# EAGLE design compass (EAGLE 9.6.1)
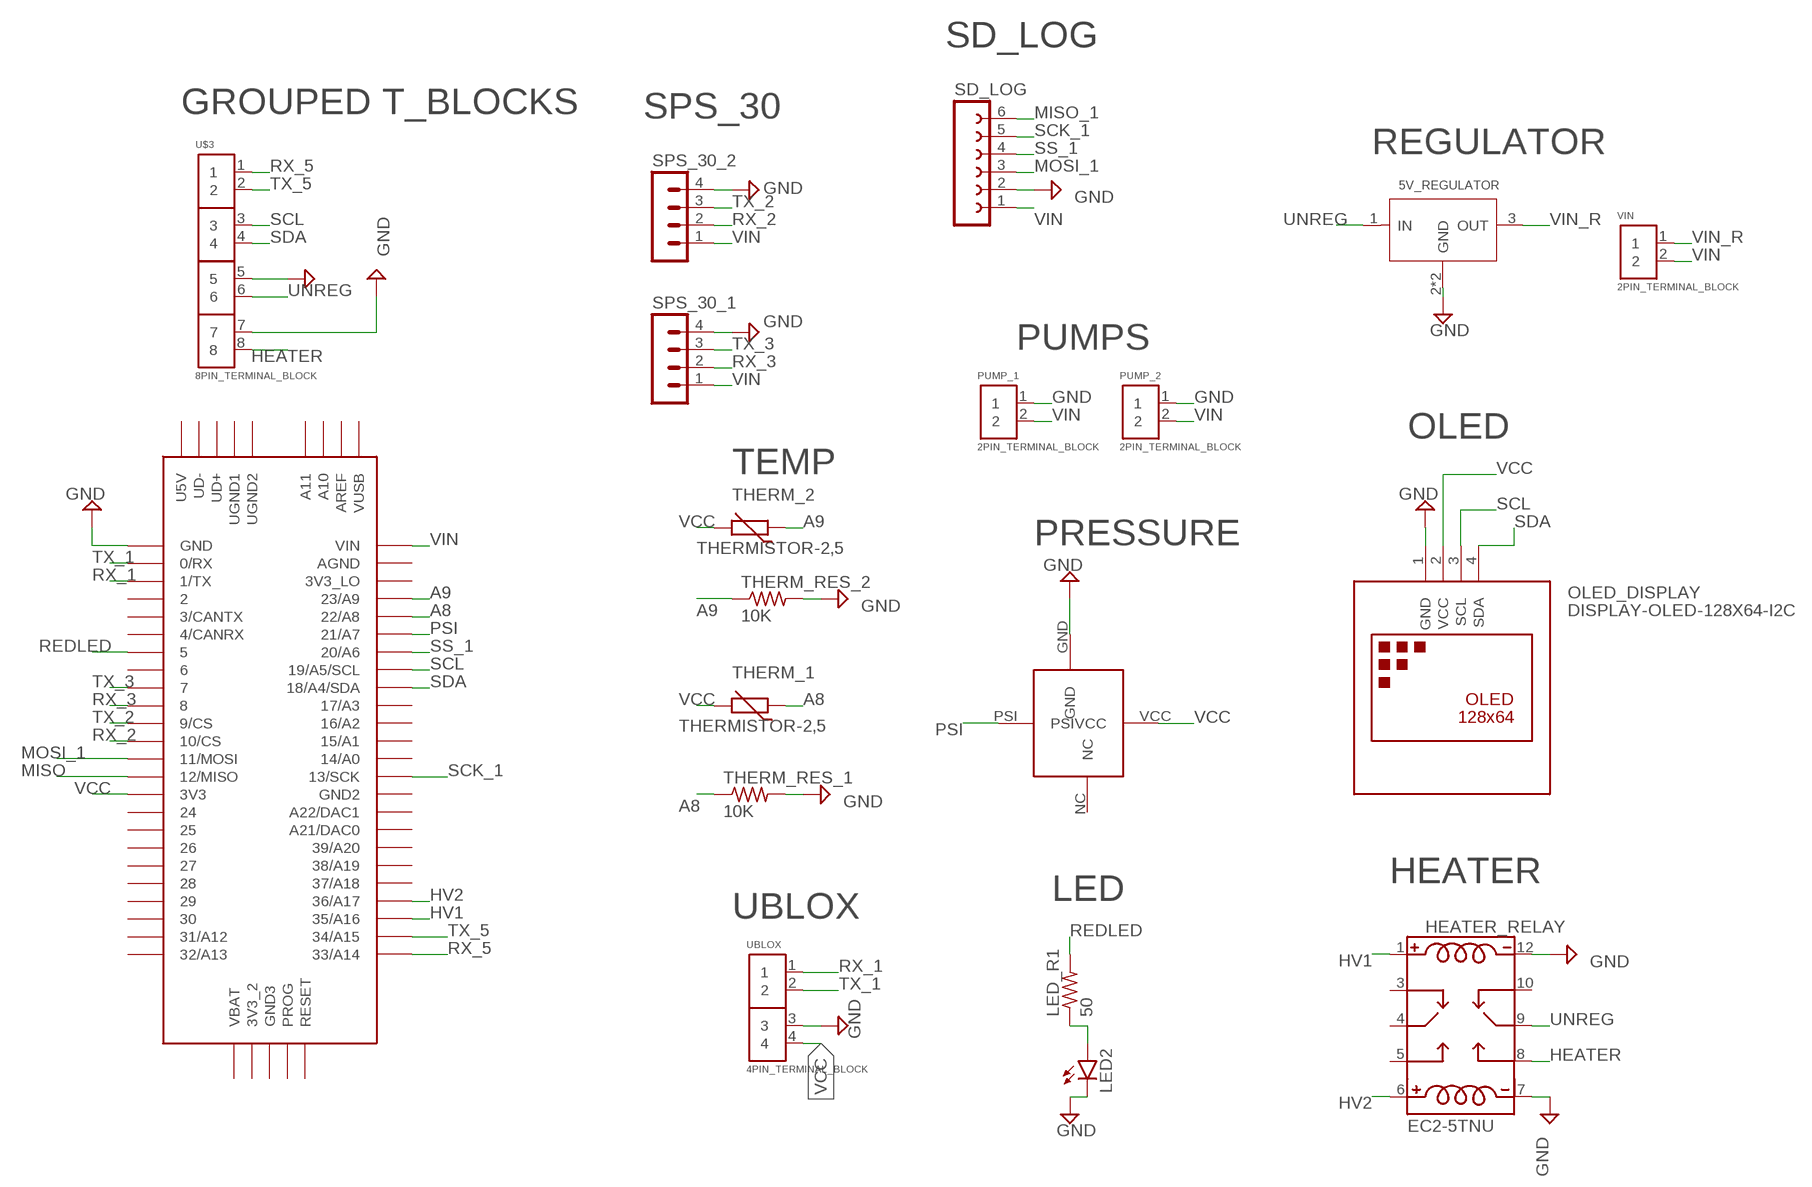
[diagram p0: schematic, sheet 1]

## Parts
5V_REGULATOR  PMIC-L7805CV-DG(TO-220)  [TO-220]
HEATER_RELAY  EC2-5TNU  [RELAY_EC2-5TNU]
LED2  TLLR4400  [LED3MM]
LED_R1  50  R-US_0204/7  [0204/7]
OLED_DISPLAY  DISPLAY-OLED-128X64-I2C  [DISPLAY-OLED-128X64-I2C]
PRESSURE_SENSOR  SSCSANN015PAAA5  [SSCSANN015PAAA5]
PUMP_1  2PIN_TERMINAL_BLOCK  [2PIN_TERMINAL_BLOCK]
PUMP_2  2PIN_TERMINAL_BLOCK  [2PIN_TERMINAL_BLOCK]
SD_LOG  FE06-1  [FE06]
SPS_30_1  MA04-1  [MA04-1]
SPS_30_2  MA04-1  [MA04-1]
THERM_1  THERMISTOR-2,5  [RS-2,5]
THERM_2  THERMISTOR-2,5  [RS-2,5]
THERM_RES_1  10K  R-US_0204/7  [0204/7]
THERM_RES_2  10K  R-US_0204/7  [0204/7]
U$1  TEENSY_3.5/3.6  [TEENSY_3.5/3.6]
U$3  8PIN_TERMINAL_BLOCK  [8PIN_TERMINAL_BLOCK]
UBLOX  4PIN_TERMINAL_BLOCK  [4PIN_TERMINAL_BLOCK]
VIN  2PIN_TERMINAL_BLOCK  [2PIN_TERMINAL_BLOCK]

## Nets
A8: THERM_1.1 THERM_RES_1.1 U$1.22/A8
A9: THERM_2.1 THERM_RES_2.1 U$1.23/A9
GND [5V_Relay]: 5V_REGULATOR.2(GND) 5V_REGULATOR.HEAT(GND) HEATER_RELAY.7(C4) HEATER_RELAY.12(C2) LED2.K(C) OLED_DISPLAY.1(GND) PRESSURE_SENSOR.GND PUMP_1.1 PUMP_2.1 SD_LOG.2 SPS_30_1.4 SPS_30_2.4 THERM_RES_1.2 THERM_RES_2.2 U$1.GND U$3.5 U$3.7 UBLOX.3
HEATER: HEATER_RELAY.8(NO) U$3.8
HV1 [5V_Relay]: HEATER_RELAY.1(C1) U$1.35/A16
HV2 [5V_Relay]: HEATER_RELAY.6(C3) U$1.36/A17
MISO: U$1.12/MISO
MISO_1: SD_LOG.6
MOSI_1: SD_LOG.3 U$1.11/MOSI
N$4: LED2.A LED_R1.1
PSI: PRESSURE_SENSOR.PSI U$1.21/A7
REDLED: LED_R1.2 U$1.5
RX_1: U$1.1/TX UBLOX.1
RX_2: SPS_30_2.2 U$1.10/CS
RX_3: SPS_30_1.2 U$1.8
RX_5: U$1.33/A14 U$3.1
SCK_1: SD_LOG.5 U$1.13/SCK
SCL: OLED_DISPLAY.3(SCL) U$1.19/A5/SCL U$3.3
SDA: OLED_DISPLAY.4(SDA) U$1.18/A4/SDA U$3.4
SS_1: SD_LOG.4 U$1.20/A6
TX_1: U$1.0/RX UBLOX.2
TX_2: SPS_30_2.3 U$1.9/CS
TX_3: SPS_30_1.3 U$1.7
TX_5: U$1.34/A15 U$3.2
UNREG: 5V_REGULATOR.1(IN) HEATER_RELAY.9(M) U$3.6
VCC: OLED_DISPLAY.2(VCC) PRESSURE_SENSOR.VCC THERM_1.2 THERM_2.2 U$1.3V3 UBLOX.4
VIN: PUMP_1.2 PUMP_2.2 SD_LOG.1 SPS_30_1.1 SPS_30_2.1 U$1.VIN VIN.2
VIN_R: 5V_REGULATOR.3(OUT) VIN.1
Unconnected: HEATER_RELAY.3(NC1) HEATER_RELAY.4(M1) HEATER_RELAY.5(NO1) HEATER_RELAY.10(NC) PRESSURE_SENSOR.NC U$1.2 U$1.3/CANTX U$1.3V3_2 U$1.3V3_LO U$1.4/CANRX U$1.6 U$1.14/A0 U$1.15/A1 U$1.16/A2 U$1.17/A3 U$1.21/DAC0(A21/DAC0) U$1.24 U$1.25 U$1.26 U$1.27 U$1.28 U$1.29 U$1.30 U$1.31/A12 U$1.32/A13 U$1.37/A18 U$1.38/A19 U$1.39/A20 U$1.A10 U$1.A11 U$1.A22/DAC1 U$1.AGND U$1.AREF U$1.GND2 U$1.GND3 U$1.PROG U$1.RESET U$1.U5V U$1.UD+ U$1.UD- U$1.UGND1 U$1.UGND2 U$1.VBAT U$1.VUSB

## Notes on the sheet
- SD_LOG
- SPS_30
- GROUPED T_BLOCKS | REGULATOR
- PUMPS
- OLED
- TEMP
- PRESSURE
- HEATER
- LED
- UBLOX

## Library data of the parts
5V_REGULATOR = PMIC-L7805CV-DG_TO-220_:PMIC-L7805CV-DG(TO-220): 310030073; DESCRIPTION: Linear Voltage Regulator IC 1 Output 1.5A TO-220; DIGI-KEY_PART_NUMBER: 497-12404-ND; MF: STMicroelectronics; MP: L7805CV-DG; PACKAGE: TO-220 STMicroelectronics
HEATER_RELAY = EC2-5TNU:EC2-5TNU: Relay; E-Mech; Latching; DPDT; Ctrl-V 5DC; 2A; 250VAC; PCB Mnt; Thru Hole; EC2/EE2 Series; AVAILABILITY: Unavailable; DESCRIPTION: Relay; E-Mech; Latching; DPDT; Ctrl-V 5DC; 2A; 250VAC; PCB Mnt; Thru Hole; EC2/EE2 Series; MF: KEMET; MP: EC2-5TNU; PACKAGE: None; PRICE: None
LED2 = led:TLLR4400: Low Current (2mA) LED 3 mm Tinted Diffused Package color RED Source: Data sheet <http://www.farnell.com/datasheets/391100.pdf>; MF: VISHAY SEMICONDUCTOR; OC_FARNELL: 1612437
LED_R1 = resistor:R-US_: RESISTOR, American symbol
OLED_DISPLAY = diy-modules:DISPLAY-OLED-128X64-I2C: 128x64 Dot Matrix OLED Module based on SSD1306 chip Variant with I2C interface More details available here: http://www.instructables.com/id/Monochrome-096-i2c-OLED-display-with-arduino-SSD13/ SSD1306 datasheet: https://cdn-shop.adafruit.com/datasheets/SSD1306.pdf Click here to find device on ebay.com <http://www.ebay.com/sch/oled+display+128x64+iic> Note: There are two variants: I2C and SPI. Search for the proper version.
PRESSURE_SENSOR = SSCSANN015PAAA5:SSCSANN015PAAA5
PUMP_1 PUMP_2 VIN = Terminal_Block:2PIN_TERMINAL_BLOCK: Terminal block; 2.54mm; angled 90°; 0.03÷1mm2; ways: 2; 10A; H: 10mm; CENTERLINE_PITCH: 2.54 mm[.1 in]; COMMENT: 282834-2; DESCRIPTION: TERMI-BLOK PCB MOUNT, 90 2P.; DIGI-KEY_PART_NUMBER: A98333-ND; DIGI-KEY_PURCHASE_URL: https://www.digikey.com/product-detail/en/te-connectivity-amp-connectors/282834-2/A98333-ND/1150135?utm_source=snapeda&utm_medium=aggregator&utm_campaign=symbol; EU_ROHS_COMPLIANCE: Compliant with Exemptions; MF: TE Connectivity; MP: 282834-2; NUMBER_OF_POSITIONS: 2; PACKAGE: None; TE_PURCHASE_URL: https://www.te.com/usa-en/product-282834-2.html?te_bu=Cor&te_type=disp&te_campaign=seda_glo_cor-seda-global-disp-prtnr-fy19-seda-model-bom-cta_sma-317_1&elqCampaignId=32493
SD_LOG = con-lsta:FE06-1: FEMALE HEADER; OC_FARNELL: unknown; OC_NEWARK: unknown
SPS_30_1 SPS_30_2 = con-lstb:MA04-1: PIN HEADER; OC_FARNELL: unknown; OC_NEWARK: unknown
THERM_1 THERM_2 = varistor:THERMISTOR: THERMISTOR
THERM_RES_1 THERM_RES_2 = rcl:R-US_: RESISTOR, American symbol; SPICEPREFIX: R
U$1 = Teensy356:TEENSY_3.5/3.6: Teensy 3.5/3.6
U$3 = 8PIN_Terminal_Block:8PIN_TERMINAL_BLOCK
UBLOX = 4PIN_Terminal_Block:4PIN_TERMINAL_BLOCK

## Net classes
1 5V_Relay: width 0.305 mm, drill 0.35 mm, clearance 0.127 mm

## Board
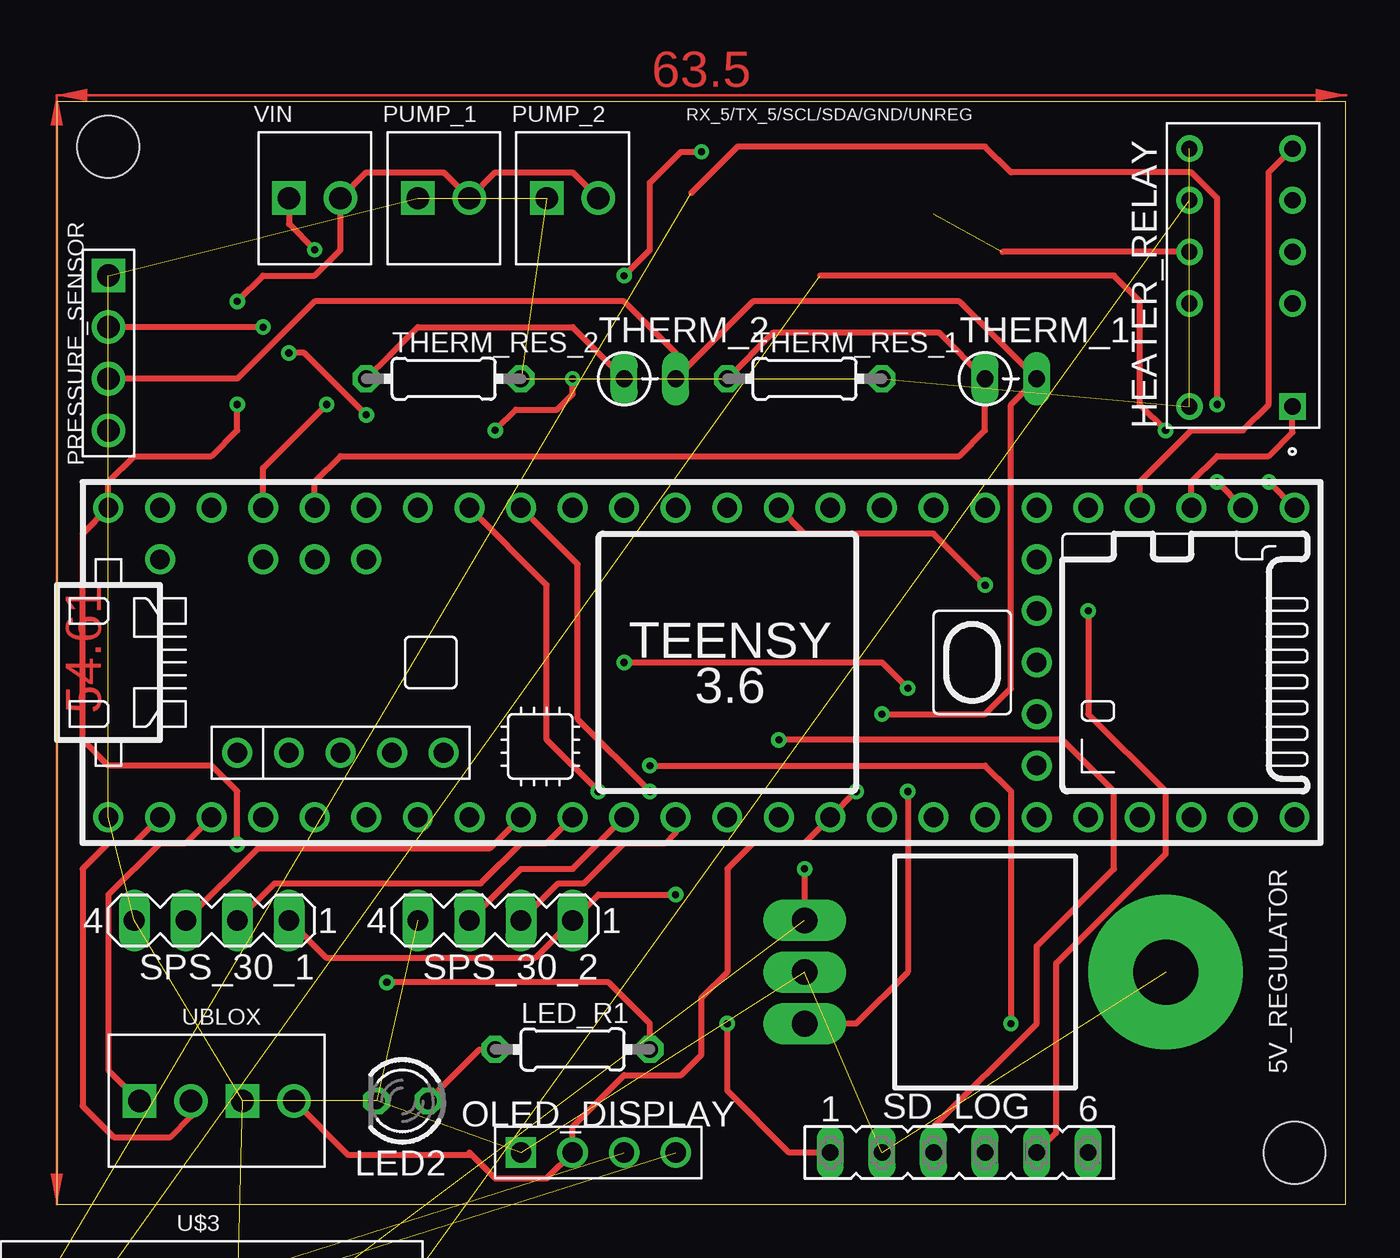
[diagram p1: board, top side]
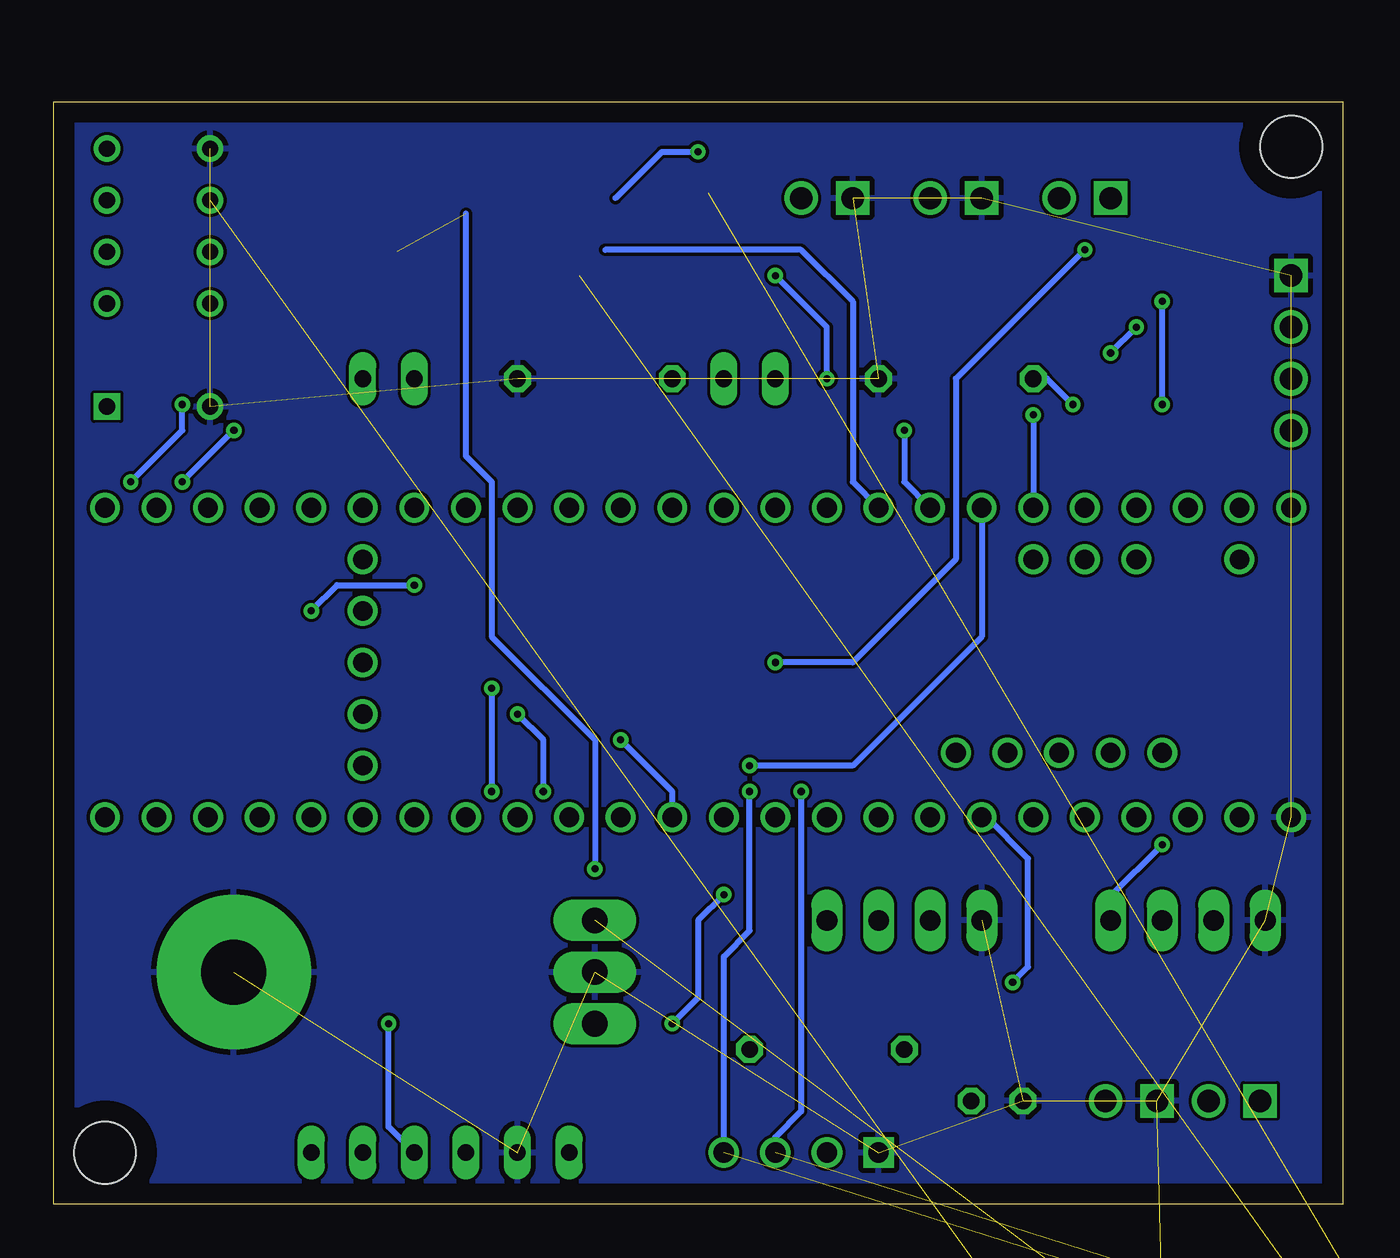
[diagram p2: board, bottom side, seen from below]

Size 63.48 x 54.28 mm. Coordinates in mm from the lower left corner, seen from the top.
Outline: 0,0 63.48,0 63.48,54.28 0,54.28 0,0
Copper layers (1*16): Top 0.035mm / dielectric 1.5mm / Bottom 0.035mm
Design rules "default": minimum track width 6mil, minimum drill 0.35mm, track to track 6mil, track to pad 6mil, pad to pad 6mil, via to via 6mil, smd to smd 6mil, copper to edge 40mil, drill to drill 6mil, minimum pad ring 10mil, minimum via ring 8mil, stop-mask expansion 4mil, vias tented up to drill 0mil, thermal gap 10mil
Holes 3.05 mm at 2.54,52.07 60.96,2.54

### Footprints (pad centres in the part's own frame; a part is rotated, then mirrored left to right if it is on the bottom)
TO-220 = drill 1.27 pad 2.032 long: 1 -2.54,-11.43; 2 0,-11.43; 3 2.54,-11.43 | drill 3.2 pad 7.62: HEAT 0,6.35
RELAY_EC2-5TNU = drill 0.8 square: 1 -6.45,-2.44 | drill 0.8: 3 -1.37,-2.44; 4 1.17,-2.44; 5 3.71,-2.44; 6 6.25,-2.44; 7 6.25,2.64; 8 3.71,2.64; 9 1.17,2.64; 10 -1.37,2.64; 12 -6.45,2.64
LED3MM = drill 0.813 octagon: A -1.27,0; K 1.27,0
0204/7 = drill 0.813 octagon: 1 -3.81,0; 2 3.81,0
DISPLAY-OLED-128X64-I2C = drill 1 square: 1 -3.81,0 | drill 1: 2 -1.27,0; 3 1.27,0; 4 3.81,0
SSCSANN015PAAA5 = drill 1.1 square: GND 3.81,0 | drill 1.1: NC -3.81,0; PSI 1.27,0; VCC -1.27,0
2PIN_TERMINAL_BLOCK = drill 1.1 square: 1 -1.27,0 | drill 1.1: 2 1.27,0
FE06 = drill 0.813 long: 1 -6.35,0; 2 -3.81,0; 3 -1.27,0; 4 1.27,0; 5 3.81,0; 6 6.35,0
MA04-1 = drill 1.016 long: 1 -3.81,0; 2 -1.27,0; 3 1.27,0; 4 3.81,0
RS-2,5 = drill 0.813 long: 1 -1.27,0; 2 1.27,0
TEENSY_3.5/3.6 = drill 0.965: 0/RX -25.4,-7.62; 1/TX -22.86,-7.62; 2 -20.32,-7.62; 3/CANTX -17.78,-7.62; 3V3 7.62,-7.62; 3V3_2 17.78,-2.54; 3V3_LO -22.86,7.62; 4/CANRX -15.24,-7.62; 5 -12.7,-7.62; 6 -10.16,-7.62; 7 -7.62,-7.62; 8 -5.08,-7.62; 9/CS -2.54,-7.62; 10/CS 0,-7.62; 11/MOSI 2.54,-7.62; 12/MISO 5.08,-7.62; 13/SCK 5.08,7.62; 14/A0 2.54,7.62; 15/A1 0,7.62; 16/A2 -2.54,7.62; 17/A3 -5.08,7.62; 18/A4/SDA -7.62,7.62; 19/A5/SCL -10.16,7.62; 20/A6 -12.7,7.62; 21/A7 -15.24,7.62; 21/DAC0 12.7,7.62; 22/A8 -17.78,7.62; 23/A9 -20.32,7.62; 24 10.16,-7.62; 25 12.7,-7.62; 26 15.24,-7.62; 27 17.78,-7.62; 28 20.32,-7.62; 29 22.86,-7.62; 30 25.4,-7.62; 31/A12 27.94,-7.62; 32/A13 30.48,-7.62; 33/A14 30.48,7.62; 34/A15 27.94,7.62; 35/A16 25.4,7.62; 36/A17 22.86,7.62; 37/A18 20.32,7.62; 38/A19 17.78,7.62; 39/A20 15.24,7.62; A10 -17.78,5.08; A11 -15.24,5.08; A22/DAC1 10.16,7.62; AGND -25.4,7.62; AREF -20.32,5.08; GND -27.94,-7.62; GND2 7.62,7.62; GND3 17.78,0; PROG 17.78,2.54; RESET 17.78,5.08; U5V -21.59,-4.445; UD+ -16.51,-4.445; UD- -19.05,-4.445; UGND1 -13.97,-4.445; UGND2 -11.43,-4.445; VBAT 17.78,-5.08; VIN -27.94,7.62; VUSB -25.4,5.08
8PIN_TERMINAL_BLOCK = drill 1.1 square: 1 -8.89,0; 3 -3.81,0; 5 1.27,0; 7 6.35,0 | drill 1.1: 2 -6.35,0; 4 -1.27,0; 6 3.81,0; 8 8.89,0
4PIN_TERMINAL_BLOCK = drill 1.1 square: 1 -3.81,0; 3 1.27,0 | drill 1.1: 2 -1.27,0; 4 3.81,0

### Placement (x,y rotation side)
5V_REGULATOR  48.26,11.43 270 top
HEATER_RELAY  58.42,45.72 90 top
LED2  17.02,5.08 180 top
LED_R1  25.4,7.62 0 top
OLED_DISPLAY  26.67,2.54 0 top
PRESSURE_SENSOR  2.54,41.91 90 top
PUMP_1  19.05,49.53 0 top
PUMP_2  25.4,49.53 0 top
SD_LOG  44.45,2.54 0 top
SPS_30_1  7.62,13.97 180 top
SPS_30_2  21.59,13.97 180 top
THERM_1  46.99,40.64 0 top
THERM_2  29.21,40.64 0 top
THERM_RES_1  36.83,40.64 0 top
THERM_RES_2  19.05,40.64 0 top
U$1  30.48,26.67 0 top
U$3  7.62,-5.08 0 top  (outside the outline)
UBLOX  7.87,5.08 0 top
VIN  12.7,49.53 0 top

### Tracks (layer width: path | path; a pad name or v marks a point on that pad's centre or on a via)
A8
  Top 0.305: U$1.22/A8 12.7,35.56 13.97,36.83 44.45,36.83 45.72,38.1 THERM_1.1 43.43,42.93 35.31,42.93 THERM_RES_1.1
A9  (via drill 0.35)
  Top 0.305: THERM_RES_2.1 16.38,41.78 16.51,41.91 17.78,43.18 25.4,43.18 THERM_2.1 | U$1.23/A9 10.16,36.24 v13.29,39.37
  Bottom 0.305: v13.29,39.37 14.56,40.64 THERM_RES_2.1
GND  (17 unrouted)
  pour Bottom: 0,54.61 0,0 63.5,0 63.5,54.61
HEATER  (1 unrouted)
  Top 0.305: 55.68,49.53 HEATER_RELAY.8
HV1
  Top 0.305: U$1.35/A16 55.88,35.56 57.15,36.83 59.69,36.83 60.86,38 HEATER_RELAY.1
HV2
  Top 0.305: U$1.36/A17 53.34,35.56 55.88,38.1 58.42,38.1 59.69,39.37 59.69,50.8 HEATER_RELAY.6
MOSI_1  (via drill 0.35)
  Top 0.305: v35.56,22.86 49.53,22.86 52.07,20.32 52.07,16.51 48.26,12.7 48.26,8.89 43.18,3.81 SD_LOG.3
  Bottom 0.305: v35.56,22.86 33.02,20.32 U$1.11/MOSI
N$4
  Top 0.305: LED2.A 20.83,7.62 LED_R1.1
PSI  (via drill 0.35)
  Top 0.305: v10.16,43.18 PRESSURE_SENSOR.PSI | v15.24,38.86 12.19,41.91 v11.43,41.91
  Bottom 0.305: v11.43,41.91 v10.16,43.18 | v15.24,38.86 U$1.21/A7
REDLED  (via drill 0.35)
  Top 0.305: LED_R1.2 29.21,8.89 27.18,10.92 v16.26,10.92
  Bottom 0.305: v16.26,10.92 15.49,11.68 15.49,17.02 17.53,19.05 U$1.5
RX_1
  Top 0.305: U$1.1/TX 6.35,17.78 5.08,17.78 2.54,15.24 2.54,6.6 UBLOX.1
RX_2
  Top 0.305: SPS_30_2.2 24.69,15.8 25.96,15.8 27.94,17.78 29.97,17.78 30.48,18.29 U$1.10/CS
RX_3
  Top 0.305: SPS_30_1.2 10.72,15.8 20.88,15.8 22.86,17.78 24.13,17.78 U$1.8
RX_5  (via drill 0.35)  (1 unrouted)
  Top 0.305: U$1.33/A14 v59.69,35.56 | v57.15,39.37 57.15,49.53 55.88,50.8 46.99,50.8 45.72,52.07 33.53,52.07 31.24,49.78
  Bottom 0.305: v59.69,35.56 57.15,38.1 v57.15,39.37
SCK_1  (via drill 0.35)
  Top 0.305: v50.8,29.21 50.8,24.13 54.61,20.32 54.61,17.25 49.22,11.86 49.22,3.51 SD_LOG.5 | v45.72,30.48 43.18,33.02 36.83,33.02 U$1.13/SCK
  Bottom 0.305: v50.8,29.21 49.53,30.48 v45.72,30.48
SCL  (via drill 0.35)  (1 unrouted)
  Top 0.305: v26.67,20.32 24.13,22.86 24.13,30.48 U$1.19/A5/SCL | v21.59,38.1 22.61,39.12 24.64,39.12 25.4,39.88 v25.4,40.64 | v27.94,45.72 29.21,46.99 29.21,50.29 30.73,51.82 v31.75,51.82
  Bottom 0.305: v21.59,38.1 21.59,35.56 U$1.19/A5/SCL | v25.4,40.64 25.4,43.18 v27.94,45.72 | v26.67,20.32 26.67,4.57 27.94,3.3 OLED_DISPLAY.3 | v31.75,51.82 33.53,51.82 35.81,49.53
SDA  (via drill 0.35)  (1 unrouted)
  Top 0.305: U$1.18/A4/SDA 25.65,31.5 25.65,23.88 v29.21,20.32
  Bottom 0.305: v29.21,20.32 29.21,13.46 30.48,12.19 OLED_DISPLAY.4 | U$1.18/A4/SDA 24.13,35.56 24.13,44.45 26.67,46.99 36.32,46.99
SS_1  (via drill 0.35)
  Top 0.305: v29.21,21.59 45.72,21.59 46.99,20.32 v46.99,8.89
  Bottom 0.305: v29.21,21.59 24.13,21.59 17.78,27.94 U$1.20/A6 | SD_LOG.4 46.99,3.81 v46.99,8.89
TX_1
  Top 0.305: U$1.0/RX 3.81,17.78 2.54,17.78 1.27,16.51 1.27,4.83 2.79,3.3 5.59,3.3 6.6,4.32 UBLOX.2
TX_2
  Top 0.305: SPS_30_2.3 22.86,16.51 25.4,16.51 U$1.9/CS
TX_3
  Top 0.305: SPS_30_1.3 9.91,17.53 21.34,17.53 U$1.7
TX_5  (via drill 0.35)  (1 unrouted)
  Top 0.305: U$1.34/A15 v57.15,35.56 | v54.61,38.1 53.34,39.37 53.34,44.45 52.07,45.72 37.59,45.72
  Bottom 0.305: v57.15,35.56 v54.61,38.1
UNREG  (via drill 0.35)  (2 unrouted)
  Top 0.305: v36.83,16.51 5V_REGULATOR.1 | HEATER_RELAY.9 46.58,46.89
  Bottom 0.305: v36.83,16.51 36.83,22.86 41.91,27.94 41.91,35.56 43.18,36.83 43.18,48.77
VCC  (via drill 0.35)
  Top 0.305: 20.32,2.54 20.45,2.41 | 20.45,2.41 21.59,1.27 24.13,1.27 OLED_DISPLAY.2 25.4,3.81 27.94,6.35 30.73,6.35 31.75,7.37 31.75,10.16 33.02,11.43 33.02,16.51 34.29,17.78 36.83,17.78 U$1.3V3 v39.37,20.32 | v40.64,24.13 45.72,24.13 46.99,25.4 46.99,39.37 THERM_1.2 44.45,44.45 34.29,44.45 THERM_2.2 30.48,41.91 27.94,44.45 12.7,44.45 8.89,40.64 PRESSURE_SENSOR.VCC | 20.45,2.41 14.35,2.41 UBLOX.4
  Bottom 0.305: v39.37,20.32 39.37,22.86 v40.64,24.13
VIN  (via drill 0.35)
  Top 0.305: SPS_30_1.1 13.26,12.14 23.57,12.14 SPS_30_2.1 26.67,15.24 v30.48,15.24 | PUMP_2.2 25.4,50.8 21.59,50.8 PUMP_1.2 19.05,50.8 15.24,50.8 VIN.2 13.97,46.99 12.7,45.72 10.16,45.72 v8.89,44.45 | v8.89,39.37 8.89,38.1 7.62,36.83 3.81,36.83 2.54,35.56 U$1.VIN 1.27,33.02 1.27,22.86 2.54,21.59 7.62,21.59 8.89,20.32 v8.89,17.7 | 37.76,2.54 SD_LOG.1 36.07,2.54 33.02,5.59 v33.02,8.89
  Bottom 0.305: v8.89,17.7 11.43,15.16 SPS_30_1.1 | v8.89,39.37 v8.89,44.45 | v30.48,15.24 31.75,13.97 31.75,10.16 v33.02,8.89
VIN_R  (via drill 0.35)
  Top 0.305: VIN.1 11.43,48.26 v12.7,46.99 | v27.94,26.67 40.64,26.67 v41.91,25.4 | v41.91,20.32 41.91,11.43 39.37,8.89 5V_REGULATOR.3
  Bottom 0.305: v12.7,46.99 19.05,40.64 19.05,31.75 24.13,26.67 v27.94,26.67 | v41.91,25.4 v41.91,20.32
(copper drawn outside any net)
  shapes: Top area x2

### Text on the board
tPlace: RX_5/TX_5/SCL/SDA/GND/UNREG